# Altium schematic sheet CM_ETHERNET.SchDoc
size Tabloid; SheetNumber: 11; SheetTotal: 14; Sheet_Name: CM_ETHERNET; Size: 11x17
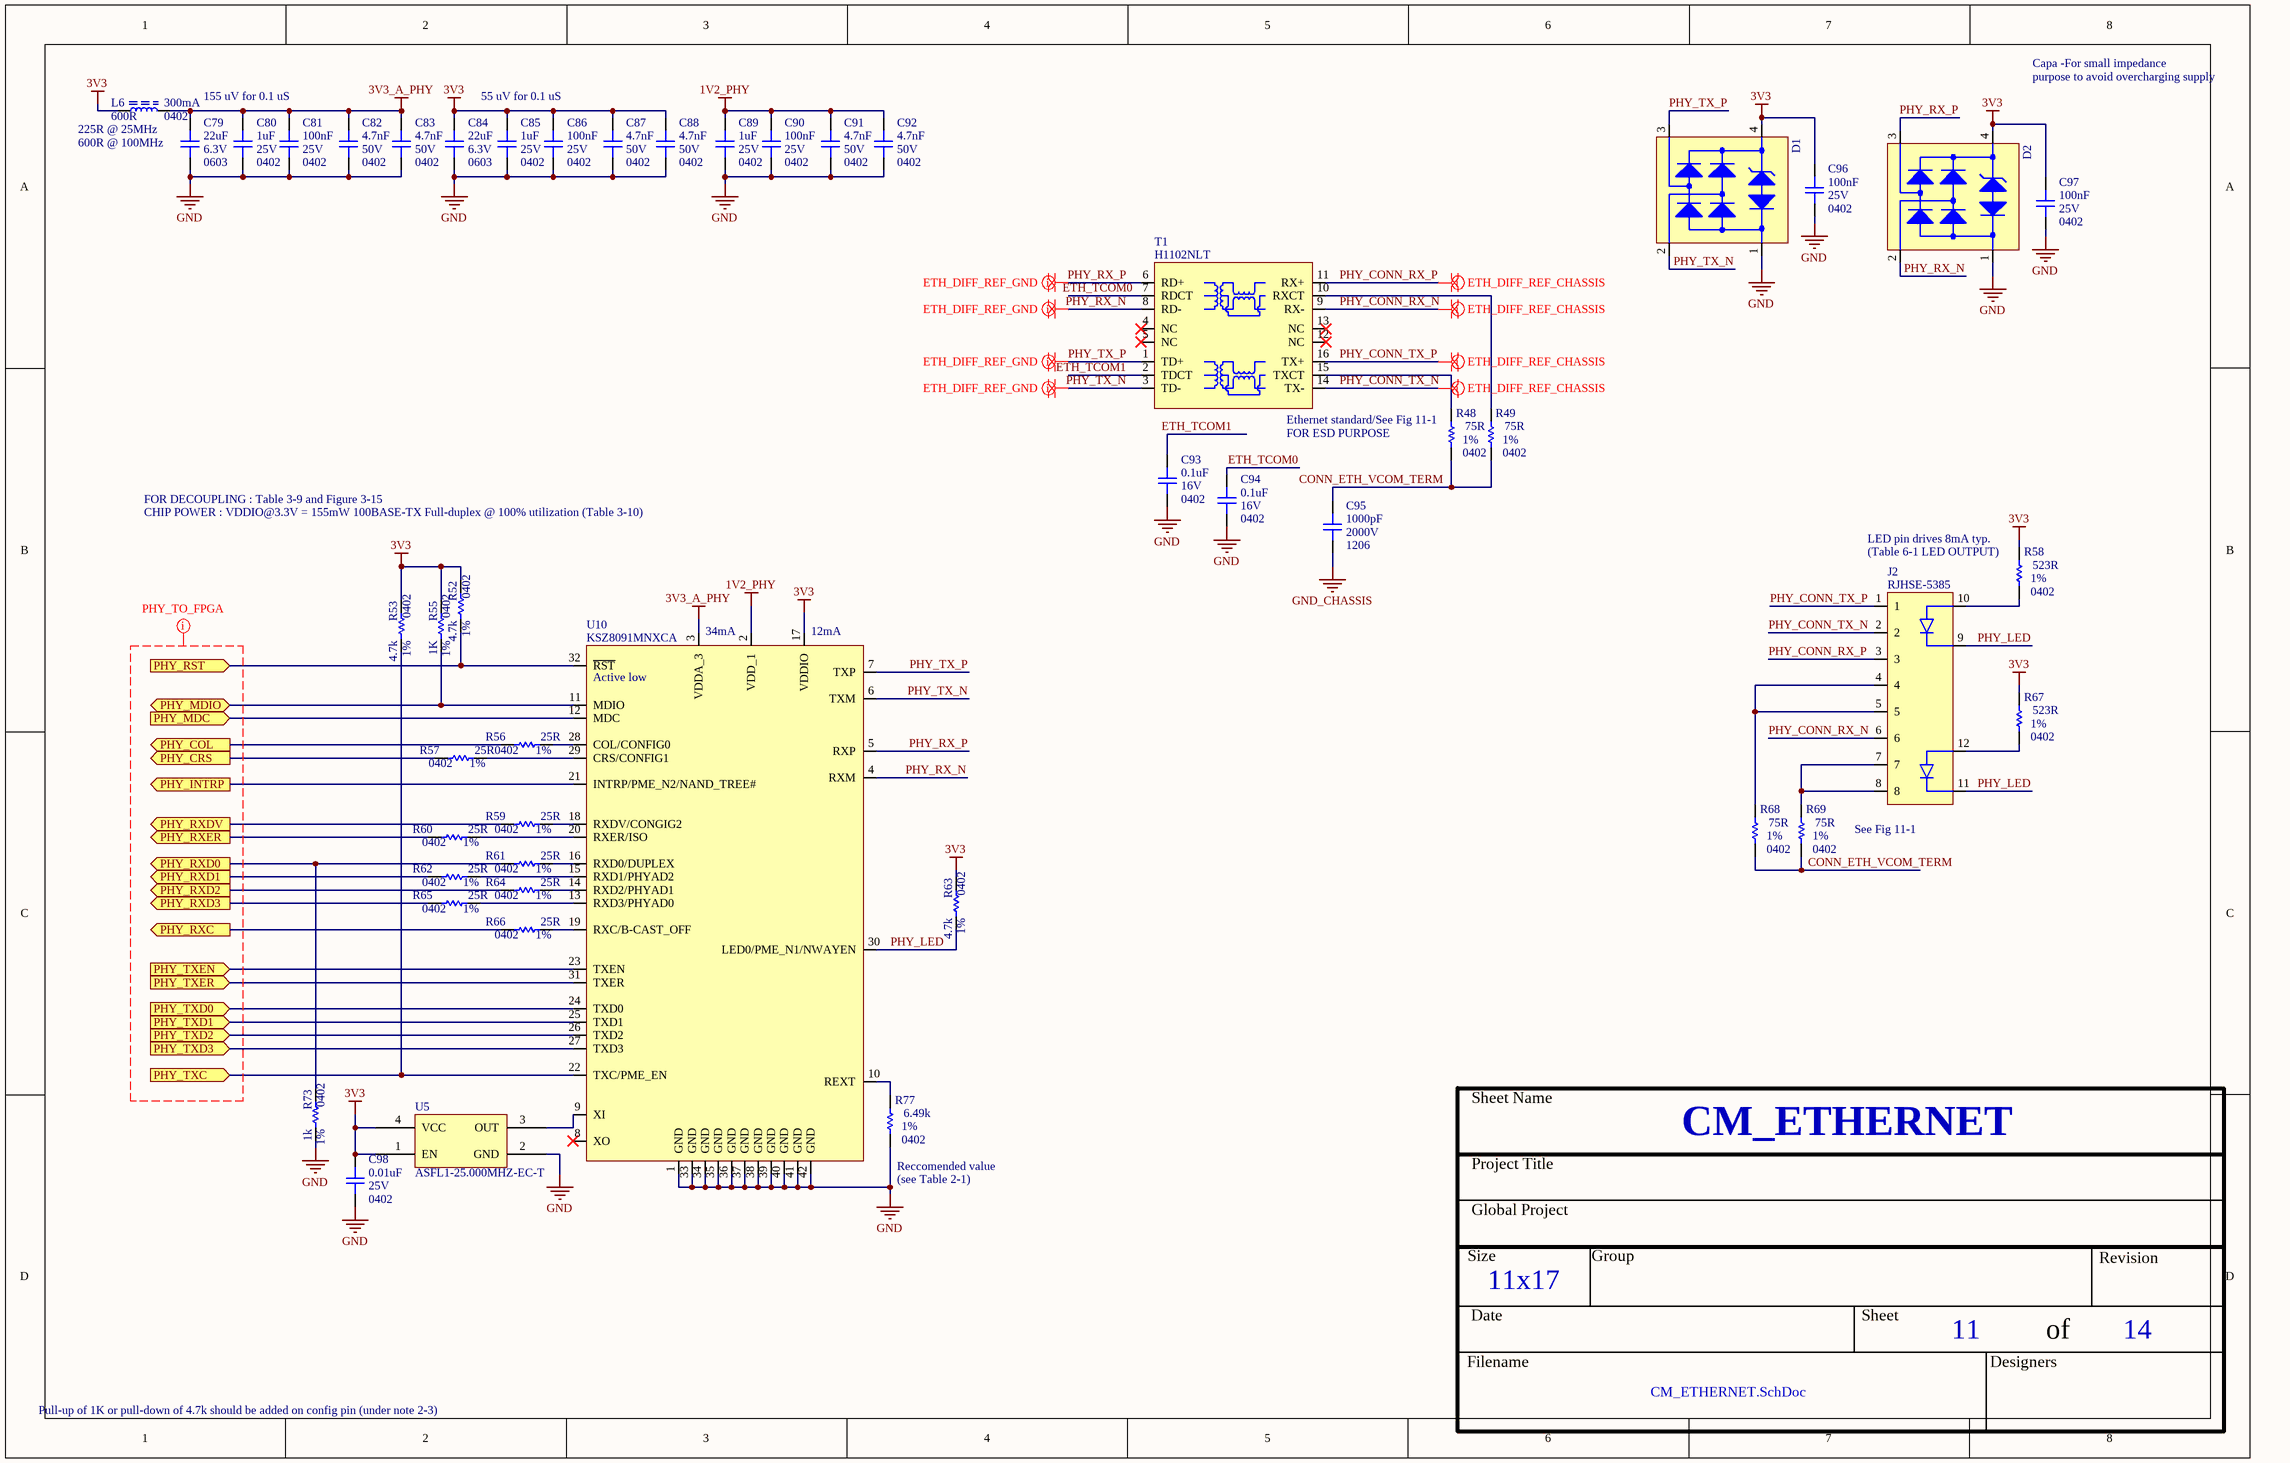
[diagram p0: CM_ETHERNET.SchDoc]

## Parts
C79  value 22uF  Voltage: 6.3V  Package: 0603  [CAP_0603]  (hidden comment: CAP - 0603)
C80  value 1uF  Voltage: 25V  Package: 0402  [CAP_0402]  (hidden comment: CAP - 0402)
C81  value 100nF  Voltage: 25V  Package: 0402  [CAP_0402]  (hidden comment: CAP - 0402)
C82  value 4.7nF  Voltage: 50V  Package: 0402  [CAP_0402]  (hidden comment: CAP - 0402)
C83  value 4.7nF  Voltage: 50V  Package: 0402  [CAP_0402]  (hidden comment: CAP - 0402)
C84  value 22uF  Voltage: 6.3V  Package: 0603  [CAP_0603]  (hidden comment: CAP - 0603)
C85  value 1uF  Voltage: 25V  Package: 0402  [CAP_0402]  (hidden comment: CAP - 0402)
C86  value 100nF  Voltage: 25V  Package: 0402  [CAP_0402]  (hidden comment: CAP - 0402)
C87  value 4.7nF  Voltage: 50V  Package: 0402  [CAP_0402]  (hidden comment: CAP - 0402)
C88  value 4.7nF  Voltage: 50V  Package: 0402  [CAP_0402]  (hidden comment: CAP - 0402)
C89  value 1uF  Voltage: 25V  Package: 0402  [CAP_0402]  (hidden comment: CAP - 0402)
C90  value 100nF  Voltage: 25V  Package: 0402  [CAP_0402]  (hidden comment: CAP - 0402)
C91  value 4.7nF  Voltage: 50V  Package: 0402  [CAP_0402]  (hidden comment: CAP - 0402)
C92  value 4.7nF  Voltage: 50V  Package: 0402  [CAP_0402]  (hidden comment: CAP - 0402)
C93  value 0.1uF  Voltage: 16V  Package: 0402  [CAP_0402]  (hidden comment: CAP - 0402)
C94  value 0.1uF  Voltage: 16V  Package: 0402  [CAP_0402]  (hidden comment: CAP - 0402)
C95  value 1000pF  Voltage: 2000V  Package: 1206  [CAP_1206]  (hidden comment: CAP - 1206)
C96  value 100nF  Voltage: 25V  Package: 0402  [CAP_0402]  (hidden comment: CAP - 0402)
C97  value 100nF  Voltage: 25V  Package: 0402  [CAP_0402]  (hidden comment: CAP - 0402)
C98  value 0.01uF  Voltage: 25V  Package: 0402  [CAP_0402]  (hidden comment: CAP - 0402)
D1  SR3.3.TCT  [TVS_SR3.3.TCT]  (value not drawn)
D2  SR3.3.TCT  [TVS_SR3.3.TCT]  (value not drawn)
J2  RJHSE-5385  [CONN_ETHERNET_RJHSE-5385]
L6  value 600R  Current: 300mA  Package: 0402  [FER_0402]  (hidden comment: FER - 0402)
R48  value 75R  Package: 0402  Precision: 1%  [RES_0402]  (hidden comment: RES - 0402)
R49  value 75R  Package: 0402  Precision: 1%  [RES_0402]  (hidden comment: RES - 0402)
R52  value 4.7k  Package: 0402  Precision: 1%  [RES_0402]  (hidden comment: RES - 0402)
R53  value 4.7k  Package: 0402  Precision: 1%  [RES_0402]  (hidden comment: RES - 0402)
R55  value 1K  Package: 0402  Precision: 1%  [RES_0402]  (hidden comment: RES - 0402)
R56  value 25R  Package: 0402  Precision: 1%  [RES_0402]  (hidden comment: RES - 0402)
R57  value 25R  Package: 0402  Precision: 1%  [RES_0402]  (hidden comment: RES - 0402)
R58  value 523R  Package: 0402  Precision: 1%  [RES_0402]  (hidden comment: RES - 0402)
R59  value 25R  Package: 0402  Precision: 1%  [RES_0402]  (hidden comment: RES - 0402)
R60  value 25R  Package: 0402  Precision: 1%  [RES_0402]  (hidden comment: RES - 0402)
R61  value 25R  Package: 0402  Precision: 1%  [RES_0402]  (hidden comment: RES - 0402)
R62  value 25R  Package: 0402  Precision: 1%  [RES_0402]  (hidden comment: RES - 0402)
R63  value 4.7k  Package: 0402  Precision: 1%  [RES_0402]  (hidden comment: RES - 0402)
R64  value 25R  Package: 0402  Precision: 1%  [RES_0402]  (hidden comment: RES - 0402)
R65  value 25R  Package: 0402  Precision: 1%  [RES_0402]  (hidden comment: RES - 0402)
R66  value 25R  Package: 0402  Precision: 1%  [RES_0402]  (hidden comment: RES - 0402)
R67  value 523R  Package: 0402  Precision: 1%  [RES_0402]  (hidden comment: RES - 0402)
R68  value 75R  Package: 0402  Precision: 1%  [RES_0402]  (hidden comment: RES - 0402)
R69  value 75R  Package: 0402  Precision: 1%  [RES_0402]  (hidden comment: RES - 0402)
R73  value 1k  Package: 0402  Precision: 1%  [RES_0402]  (hidden comment: RES - 0402)
R77  value 6.49k  Package: 0402  Precision: 1%  [RES_0402]  (hidden comment: RES - 0402)
T1  H1102NLT  [TRANSFO_H1102NLT]
U5  ASFL1-25.000MHZ-EC-T  [ASFL1]
U10  KSZ8091MNXCA  [COM_ETH_PHY_KSZ8091MNXCA]

## Ports
PHY_COL (out), PHY_CRS (out), PHY_INTRP (out), PHY_MDC (in), PHY_MDIO (bidir), PHY_RST (in), PHY_RXC (out), PHY_RXD0 (out), PHY_RXD1 (out), PHY_RXD2 (out), PHY_RXD3 (out), PHY_RXDV (out), PHY_RXER (out), PHY_TXC (in), PHY_TXD0 (in), PHY_TXD1 (in), PHY_TXD2 (in), PHY_TXD3 (in), PHY_TXEN (in), PHY_TXER (in)

## Nets
1V2_PHY: C89.2 C90.2 C91.2 C92.2 U10.2(VDD_1)
3V3: C84.2 C85.2 C86.2 C87.2 C88.2 C96.2 C97.2 C98.2 D1.4 D2.4 L6.2 R52.2 R53.2 R55.2 R58.2 R63.2 R67.2 U5.1(EN) U5.4(VCC) U10.17(VDDIO)
3V3_A_PHY: C79.2 C80.2 C81.2 C82.2 C83.2 L6.1 U10.3(VDDA_3)
GND: C79.1 C80.1 C81.1 C82.1 C83.1 C84.1 C85.1 C86.1 C87.1 C88.1 C89.1 C90.1 C91.1 C92.1 C93.1 C94.1 C96.1 C97.1 C98.1 D1.1(I/O) D2.1(I/O) R73.1 R77.1 U5.2(GND) U10.1(GND) U10.33(GND) U10.34(GND) U10.35(GND) U10.36(GND) U10.37(GND) U10.38(GND) U10.39(GND) U10.40(GND) U10.41(GND) U10.42(GND)
GND_CHASSIS: C95.1
CONN_ETH_VCOM_TERM: C95.2 R48.1 R49.1 R68.1 R69.1
ETH_TCOM0: C94.2 T1.7(RDCT)
ETH_TCOM1: C93.2 T1.2(TDCT)
PHY_COL: R56.2 ; port PHY_COL
PHY_CONN_RX_N: J2.6 T1.9(RX-)
PHY_CONN_RX_P: J2.3 T1.11(RX+)
PHY_CONN_TX_N: J2.2 T1.14(TX-)
PHY_CONN_TX_P: J2.1 T1.16(TX+)
PHY_CRS: R57.2 ; port PHY_CRS
PHY_INTRP: U10.21(INTRP/PME_N2/NAND_TREE#) ; port PHY_INTRP
PHY_LED: J2.9(LED1_K) J2.11(LED2_K) R63.1 U10.30(LED0/PME_N1/NWAYEN)
PHY_MDC: U10.12(MDC) ; port PHY_MDC
PHY_MDIO: R55.1 U10.11(MDIO) ; port PHY_MDIO
PHY_RST: R52.1 U10.32(~{RST}) ; port PHY_RST
PHY_RX_N: D2.2(VN) T1.8(RD-) U10.4(RXM)
PHY_RX_P: D2.3 T1.6(RD+) U10.5(RXP)
PHY_RXC: R66.2 ; port PHY_RXC
PHY_RXD0: R61.2 R73.2 ; port PHY_RXD0
PHY_RXD1: R62.2 ; port PHY_RXD1
PHY_RXD2: R64.2 ; port PHY_RXD2
PHY_RXD3: R65.2 ; port PHY_RXD3
PHY_RXDV: R59.2 ; port PHY_RXDV
PHY_RXER: R60.2 ; port PHY_RXER
PHY_TX_N: D1.2(VN) T1.3(TD-) U10.6(TXM)
PHY_TX_P: D1.3 T1.1(TD+) U10.7(TXP)
PHY_TXC: R53.1 U10.22(TXC/PME_EN) ; port PHY_TXC
PHY_TXD0: U10.24(TXD0) ; port PHY_TXD0
PHY_TXD1: U10.25(TXD1) ; port PHY_TXD1
PHY_TXD2: U10.26(TXD2) ; port PHY_TXD2
PHY_TXD3: U10.27(TXD3) ; port PHY_TXD3
PHY_TXEN: U10.23(TXEN) ; port PHY_TXEN
PHY_TXER: U10.31(TXER) ; port PHY_TXER
NetJ2_4: J2.4 J2.5 R68.2
NetJ2_7: J2.7 J2.8 R69.2
NetJ2_10: J2.10(LED1_A) R58.1
NetJ2_12: J2.12(LED2_A) R67.1
NetR48_2: R48.2 T1.15(TXCT)
NetR49_2: R49.2 T1.10(RXCT)
NetR56_1: R56.1 U10.28(COL/CONFIG0)
NetR57_1: R57.1 U10.29(CRS/CONFIG1)
NetR59_1: R59.1 U10.18(RXDV/CONGIG2)
NetR60_1: R60.1 U10.20(RXER/ISO)
NetR61_1: R61.1 U10.16(RXD0/DUPLEX)
NetR62_1: R62.1 U10.15(RXD1/PHYAD2)
NetR64_1: R64.1 U10.14(RXD2/PHYAD1)
NetR65_1: R65.1 U10.13(RXD3/PHYAD0)
NetR66_1: R66.1 U10.19(RXC/B-CAST_OFF)
NetR77_2: R77.2 U10.10(REXT)
NetU5_3: U5.3(OUT) U10.9(XI)

Not connected (* = marked no-connect by the designer): T1 4(NC)* 5(NC)* 12(NC)* 13(NC)*; U10 8(XO)*

## Layout directives
differential pair: PHY_CONN_RX_N, PHY_CONN_RX_P, PHY_CONN_TX_N, PHY_CONN_TX_P, PHY_RX_N, PHY_RX_P, PHY_TX_N, PHY_TX_P
net class PHY_TO_FPGA: (no net found under the mark)
net class ETH_DIFF_CHASSIS: PHY_CONN_RX_N, PHY_CONN_RX_P, PHY_CONN_TX_N, PHY_CONN_TX_P
net class ETH_DIFF_GND: PHY_RX_N, PHY_RX_P, PHY_TX_N, PHY_TX_P

## Notes on the sheet
- Capa -For small impedance
- purpose to avoid overcharging supply
- (near L6) 225R @ 25MHz
- 600R @ 100MHz
- 155 uV for 0.1 uS
- 55 uV for 0.1 uS
- (near R48) Ethernet standard/See Fig 11-1
- (near T1) FOR ESD PURPOSE
- FOR DECOUPLING : Table 3-9 and Figure 3-15
- CHIP POWER : VDDIO@3.3V = 155mW 100BASE-TX Full-duplex @ 100% utilization (Table 3-10)
- (near R58) LED pin drives 8mA typ.
- (near R58) (Table 6-1 LED OUTPUT)
- (near U10) Active low
- (near U10) 34mA
- (near U10) 12mA
- See Fig 11-1
- Reccomended value
- (see Table 2-1)
- Pull-up of 1K or pull-down of 4.7k should be added on config pin (under note 2-3)
- Sheet Name
- Project Title
- Global Project
- Size
- Group
- Revision
- Date
- Sheet
- of
- Filename
- Designers

## Library data of the parts
C79 C84 = CAP - 0603: Precision: 10%; Current: *; CreatedBy: Jonathan Bouchard; Power: *
C80-C83 C85-C94 C96-C98 = CAP - 0402: Precision: 10%; Current: *; CreatedBy: Jonathan Bouchard; Power: *
C95 = CAP - 1206: Precision: 10%; Current: *; CreatedBy: Jonathan Bouchard; Power: *
D1 D2 = TVS_SR3.3.TCT: TVS - DIODE ARRAY 3.3V 150W - SOT143-4; Mfg: Semtech; Voltage: VBR=3.3V; Current: *; Mfg Part Number: SR3.3.TCT; HelpURL: http://www.semtech.com/images/datasheet/sr3.3.pdf; CreatedBy: Jonathan Bouchard; Temperature: -55°C to 125°C; Power: 150W; Package: SOT143-4; Precision: *; Value: *; Supplier 1: Digikey; Supplier Part Number 1: SR3.3DKR-ND
J2 = CONN_ETHERNET_RJHSE-5385: CONN - MOD JACK RJ45 R/A ETHERNET - TH; Mfg: Amphenol; Voltage: *; Current: *; Power: *; Mfg Part Number: RJHSE-5385; HelpURL: https://www.amphenolcanada.com/ProductSearch/drawings/AC/RJHSE538X.pdf; CreatedBy: Jonathan Bouchard; Temperature: -55°C ~ 85°C; Value: *; Precision: *; Package: TH-12; Supplier 1: Digikey; Supplier Part Number 1: RJHSE-5385-ND
R48 R49 R52 R53 R55-R69 R73 R77 = RES - 0402: Voltage: 50V; Power: 1/16W; Current: *; CreatedBy: Jonathan Bouchard
T1 = TRANSFO_H1102NLT: TRANSFO - ETHERNET 10/100B-TX - SMD-16; Mfg: Pulse Eng.; Value: 1:1 (350uH); Voltage: *; Current: *; Power: *; Mfg Part Number: H1102NLT; HelpURL: http://media.digikey.com/pdf/Data%20Sheets/Pulse%20PDFs/10_100BASE-T%20Single%20Port%20SMD%20Magnetics_Rev2008.pdf; CreatedBy: Jonathan Bouchard; Temperature: -40°C to 85°C; Precision: *; Package: SMD-16; Supplier 1: Digikey; Supplier Part Number 1: 553-1532-1-ND
U10 = COM_ETH_PHY_KSZ8091MNXCA: COM - ETHERNET PHY 10/100 - QFN-32; Voltage: 1.8V, 2.5V, 3.3V; Mfg: Micrel; Current: *; Power: *; Mfg Part Number: KSZ8091MNXCA; HelpURL: http://ww1.microchip.com/downloads/en/DeviceDoc/00002275A.pdf; CreatedBy: Jonathan Bouchard; Temperature: 0°C ~ 70°C; Value: *; Precision: *; Package: QFN-32; Supplier 1: Digikey; Supplier Part Number 1: 576-4356-ND
L6 = FER - 0402: Voltage: *; CreatedBy: Jonathan Bouchard; Power: *; Precision: *